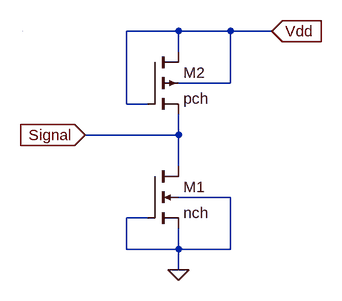
[diagram p0: schematic ESD.asc]
ESD.asc, the LTspice schematic file:
Version 4
SHEET 1 880 680
WIRE 240 0 160 0
WIRE 320 0 240 0
WIRE 384 0 320 0
WIRE 240 32 240 0
WIRE 320 80 320 0
WIRE 320 80 240 80
WIRE 160 112 160 0
WIRE 192 112 160 112
WIRE 240 160 240 128
WIRE 240 160 96 160
WIRE 240 208 240 160
WIRE 320 256 240 256
WIRE 192 288 160 288
WIRE 160 336 160 288
WIRE 240 336 240 304
WIRE 240 336 160 336
WIRE 320 336 320 256
WIRE 320 336 240 336
WIRE 240 368 240 336
WIRE 0 0 0 0
FLAG 384 0 Vdd
IOPIN 384 0 In
FLAG 96 160 Signal
IOPIN 96 160 In
FLAG 240 368 0
SYMBOL nmos4 192 208 R0
SYMATTR InstName M1
SYMATTR Value nch
SYMATTR Value2 l=6u w=48u ad={8u*48u} as={8u*48u} pd={16u+48u} ps={16u+48u}
SYMBOL pmos4 192 32 R0
SYMATTR InstName M2
SYMATTR Value pch
SYMATTR Value2 l=6u w=48u ad={8u*48u} as={8u*48u} pd={16u+48u} ps={16u+48u}

The netlist it stands for:
* ESD.asc
M1 Signal 0 0 0 nch l=6u w=48u ad={8u*48u} as={8u*48u} pd={16u+48u} ps={16u+48u}
M2 Vdd Vdd Signal Vdd pch l=6u w=48u ad={8u*48u} as={8u*48u} pd={16u+48u} ps={16u+48u}
.model NMOS NMOS
.model PMOS PMOS
.lib standard.mos
.backanno
.end